# EAGLE design YOTSUBA_GNSS-UNIT_ver.1.0 (EAGLE 9.6.2)
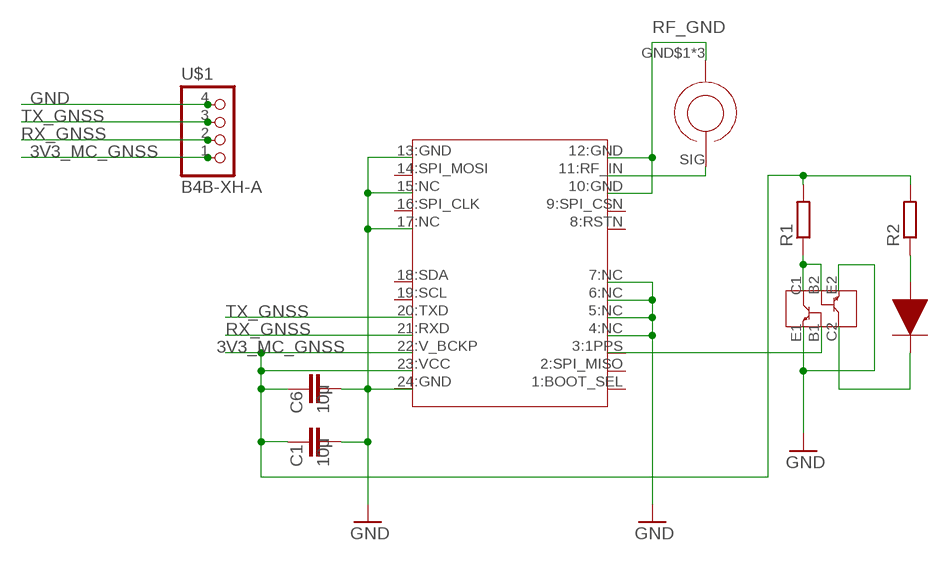
[diagram p0: schematic, sheet 1]

## Parts
C1  10μ  C-EUC2012  [C2012]
C6  10μ  C-EUC2012  [C2012]
ON/1PPS  LED_1608  [LED_1608]
R1  R-EU_M2012  [M2012]
R2  R-EU_M2012  [M2012]
U$1  B4B-XH-A  [B4B-XH-A]
U$2  ORION_B16  [ORION_B16]
U$3  HN1C01FU  [SOT65P210X100-6N]
U$5  U.FL-R  [U.FL-R]

## Nets
3V3_MC_GNSS [POWER]: C1.1 C6.1 R1.2 R2.2 U$1.1 U$2.22:V_BCKP U$2.23:VCC
GND [gnd]: C1.2 C6.2 U$1.4 U$2.4:NC U$2.5:NC U$2.6:NC U$2.7:NC U$2.13:GND U$2.15:NC U$2.17:NC U$2.24:GND U$3.E1 U$3.E2
N$10: ON/1PPS.A R2.1
N$11: ON/1PPS.C U$3.C2
N$12: U$2.3:1PPS U$3.B1
N$13: R1.1 U$3.B2 U$3.C1
N$18 [ant]: U$2.11:RF_IN U$5.SIG
RF_GND [gnd]: U$2.10:GND U$2.12:GND U$5.GND$1(GND) U$5.GND$2(GND) U$5.GND$3(GND)
RX_GNSS: U$1.2 U$2.21:RXD
TX_GNSS: U$1.3 U$2.20:TXD
Unconnected: U$2.1:BOOT_SEL U$2.2:SPI_MISO U$2.8:RSTN U$2.9:SPI_CSN U$2.14:SPI_MOSI U$2.16:SPI_CLK U$2.18:SDA U$2.19:SCL

## Library data of the parts
C1 C6 = rcl:C-EU: CAPACITOR, European symbol; SPICEPREFIX: C
ON/1PPS = LED_1608:LED_1608
R1 R2 = rcl:R-EU_: RESISTOR, European symbol; SPICEPREFIX: R
U$1 = MITSUBA_Connectors-v4.0:B4B-XH-A
U$2 = Orion_B16:ORION_B16
U$3 = HN1C01FU:HN1C01FU
U$5 = U.FL-R:U.FL-R

## Net classes
1 ant: clearance 0.2 mm
2 gnd: clearance 0.2 mm to class 1, clearance 0.508 mm
3 POWER: width 0.305 mm, clearance 0.254 mm

## Board
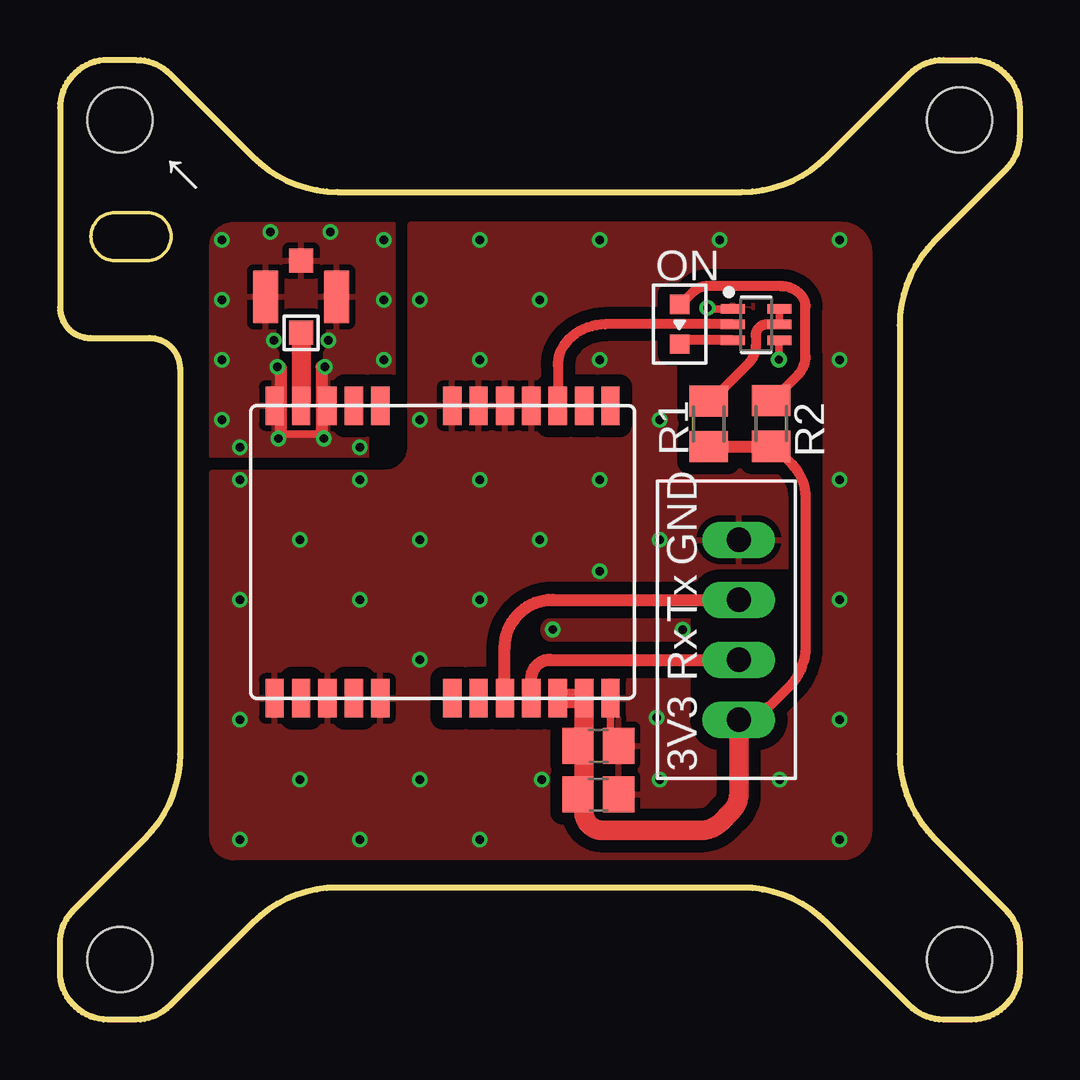
[diagram p1: board, top side]
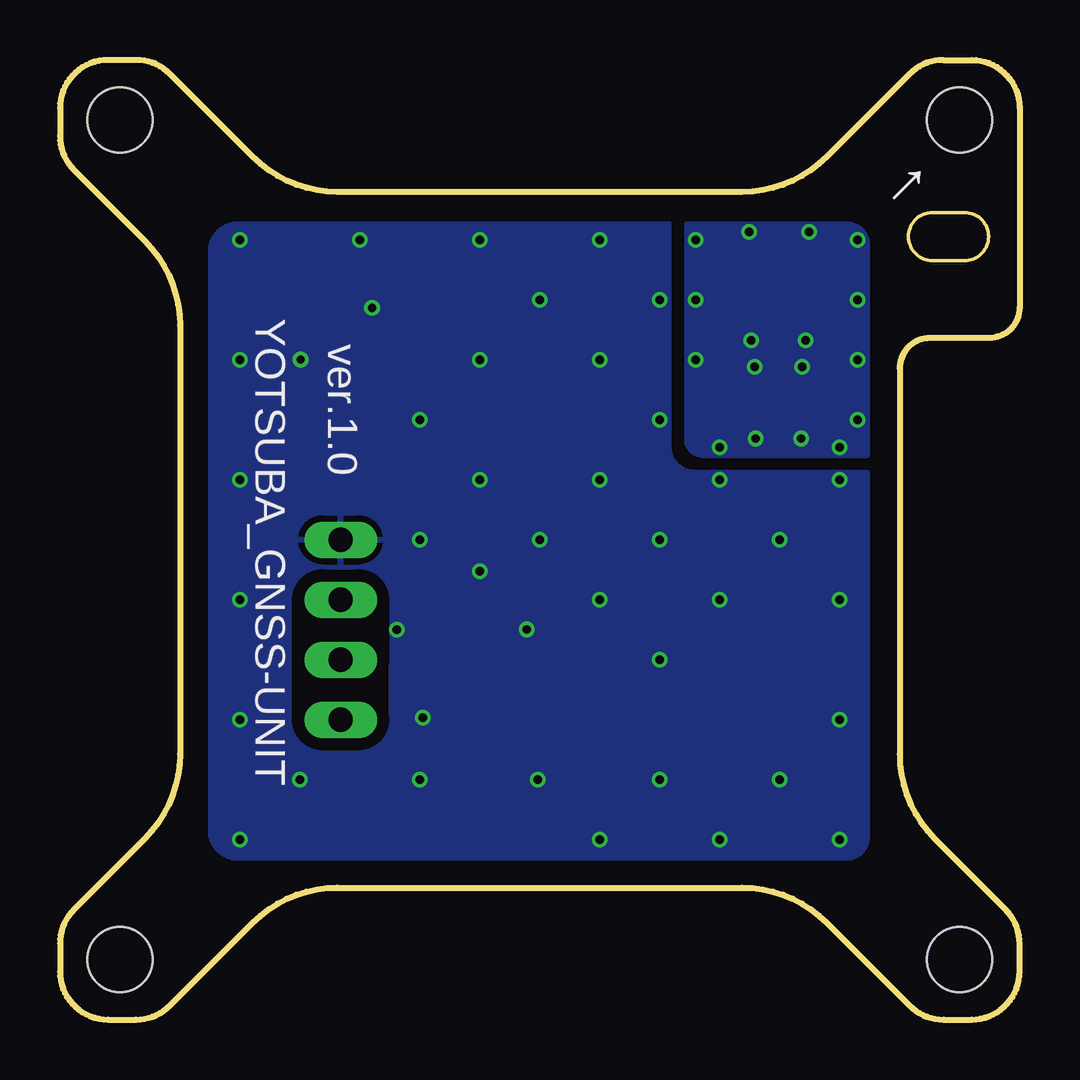
[diagram p2: board, bottom side, seen from below]

Size 40 x 40 mm. Coordinates in mm from the lower left corner, seen from the top.
Outline: 35.41,0.59 31.96,4.04 arc45 28.43,5.5 11.57,5.5 arc45 8.04,4.04 4.59,0.59 arc-45 3.17,0 2,0 arc-90 0,2 0,3.17 arc-45 0.59,4.59 3.54,7.54 arc45 5,11.07 5,27.14 arc90 3.73,28.41 1.27,28.41 arc-90 0,29.68 0,38 arc-90 2,40 3.17,40 arc-45 4.59,39.41 8.04,35.96 arc45 11.57,34.5 28.43,34.5 arc45 31.96,35.96 35.41,39.41 arc-45 36.83,40 38,40 arc-90 40,38 40,36.83 arc-45 39.41,35.41 36.46,32.46 arc45 35,28.93 35,11.07 arc45 36.46,7.54 39.41,4.59 arc-45 40,3.17 40,2 arc-90 38,0 36.83,0 arc-45 35.41,0.59
Outline: 4.63,32.64 arc-90 3.63,31.64 2.29,31.64 arc-90 1.29,32.64 arc-90 2.29,33.64 3.63,33.64 arc-90 4.63,32.64
Copper layers (1*16): Top 0.035mm / dielectric 1.53mm / Bottom 0.035mm
Design rules "pban_5mil-l2": minimum track width 5mil, minimum drill 0.3mm, track to track 5mil, track to pad 0.229mm, pad to pad 5mil, via to via 5mil, smd to smd 5mil, copper to edge 0.5mm, drill to drill 0.5mm, minimum pad ring 0.15mm, minimum via ring 0.15mm, stop-mask expansion 4mil, vias tented up to drill 0.35mm, thermal gap 10mil
Holes 2.7 mm at 2.5,2.5 37.5,2.5 37.5,37.5 2.5,37.5
tRestrict: area 31.6,21.9 to 31.8,27.3; area 25.7,26.5 to 26,27.4; area 29,18.5 to 30.5,18.8; area 12.9,23.2 to 13.4,24.4; area 29.4,26.9 to 30.6,28; area 9.4,24.6 to 10.7,24.6; 4 lines
bRestrict: 4 lines

### Footprints (pad centres in the part's own frame; a part is rotated, then mirrored left to right if it is on the bottom)
C2012 = smd 1.3 x 1.5: 1 -0.85,0; 2 0.85,0
LED_1608 = smd 0.8 x 0.8: A 0.4,0.4; C 2.05,0.4
M2012 = smd 1.3 x 1.6: 1 -0.95,0; 2 0.95,0
B4B-XH-A = drill 1.016 long: 1 0,0; 2 2.5,0; 3 5,0; 4 7.5,0
ORION_B16 = smd 1.6 x 0.8: 1:BOOT_SEL 12.2,1; 2:SPI_MISO 12.2,2.1; 3:1PPS 12.2,3.2; 4:NC 12.2,4.3; 5:NC 12.2,5.4; 6:NC 12.2,6.5; 7:NC 12.2,7.6; 8:RSTN 12.2,10.6; 9:SPI_CSN 12.2,11.7; 10:GND 12.2,12.8; 11:RF_IN 12.2,13.9; 12:GND 12.2,15; 13:GND 0,15; 14:SPI_MOSI 0,13.9; 15:NC 0,12.8; 16:SPI_CLK 0,11.7; 17:NC 0,10.6; 18:SDA 0,7.6; 19:SCL 0,6.5; 20:TXD 0,5.4; 21:RXD 0,4.3; 22:V_BCKP 0,3.2; 23:VCC 0,2.1; 24:GND 0,1
SOT65P210X100-6N = smd 1.005 x 0.397: B1 -0.962,0; B2 0.962,0; C1 0.962,0.65; C2 -0.962,-0.65; E1 -0.962,0.65; E2 0.962,-0.65
U.FL-R = smd 1.05 x 2.2: GND$1 -1.475,0; GND$2 1.475,0 | smd 1.05 x 1: GND$3 0,1.5; SIG 0,-1.5

### Placement (x,y rotation side)
C1  22.44,11.41 0 top
C6  22.44,9.38 0 top
ON/1PPS  25.43,30.21 270 top
R1  27.04,24.83 270 top
R2  29.65,24.85 270 top
U$1  28.3,12.5 90 top
U$2  23.95,13.39 90 top
U$3  29.02,28.97 0 top
U$5  10.05,30.13 0 top

### Tracks (layer width: path | path; a pad name or v marks a point on that pad's centre or on a via)
3V3_MC_GNSS
  Top 0.406: 29.63,23.88 R2.2 29.76,23.9 30.49,23.17 arc-45 31.08,21.75 31.08,15.54 arc-45 30.38,13.86 29.69,13.17 arc-45 28.99,12.88 28.61,12.5 U$1.1
  Top 0.508: R1.2 29.63,23.88
  Top 0.61: U$2.23:VCC 21.64,13.39
  Top 0.813: U$2.23:VCC 21.85,11.42 21.77,11.42 21.77,11.41 | 21.77,11.41 21.84,11.41 21.84,9.63 C6.1 21.84,9.13 21.84,8.67 arc45 22.07,8.11 arc45 22.61,7.89 26.73,7.89 arc45 27.55,8.23 27.97,8.65 arc45 28.3,9.44 U$1.1 | 21.77,11.41 C1.1 | 21.64,13.39 U$2.22:V_BCKP
GND  (via drill 0.35)
  Top 0.2: 26.99,29.62 v26.99,29.66
  Top 0.305: U$3.E2 29.97,28.31 v29.97,27.51 | U$3.E1 26.99,29.62 | U$2.24:GND 22.95,11.41 C1.2
  other vias: 25.96,16.25 10,10 15,10 12.5,7.5 17.5,7.5 12.5,17.5 10,20 15,20 17.5,17.5 20,20 25,20 22.5,22.5 17.5,22.5 12.5,22.5 7.5,22.5 7.5,17.5 7.5,12.5 7.5,7.5 32.5,7.5 32.5,12.5 32.5,17.5 32.5,22.5 32.5,27.5 32.5,32.5 27.5,32.5 22.5,32.5 17.5,32.5 17.5,27.5 20,30 22.5,27.5 25,25 25,10 30,10 15,15 15,30 15,25 20.54,16.26 20.08,10 24.88,12.58 22.5,18.69
  pour Top: 14.6,33.17 32.57,33.17 arc-90 33.75,31.99 33.75,7.89 arc-90 32.59,6.73 7.26,6.73 arc-90 6.33,7.66 6.33,22.82 13.52,22.82 arc90 14.6,23.91
  pour Bottom: 14.6,33.16 32.6,33.16 arc-90 33.74,32.02 33.74,7.88 arc-90 32.59,6.73 7.22,6.73 arc-90 6.33,7.62 6.33,22.81 13.55,22.81 arc90 14.6,23.86
N$10
  Top 0.406: R2.1 29.7,25.8 30.74,26.84 arc45 31.08,27.66 31.08,29.7 arc45 30.86,30.24 arc45 30.06,30.57 26.97,30.57 arc45 26.41,30.34 25.85,29.79 ON/1PPS.A
N$11
  Top 0.406: U$3.C2 25.99,28.32 ON/1PPS.C
N$12
  Top 0.406: U$3.B1 28.05,28.98 22.73,28.98 arc45 21.2,28.34 arc45 20.75,27.27 U$2.3:1PPS
N$13
  Top 0.305: U$3.B2 U$3.C1
  Top 0.406: U$3.B2 29.42,28.97 arc45 29.15,28.86 arc45 29,28.5 29,28.09 arc-45 28.69,27.34 27.13,25.78 R1.1
N$18
  Top 0.8: U$5.SIG U$2.11:RF_IN
RF_GND  (via drill 0.35)
  Top 0.305: 9.2,24.41 11,24.41 v11,24.22 | v9.07,27.21 9.2,27.21
  Top 0.508: 9.2,27.21 9.2,24.41 | v11.04,27.21 10.92,27.21 | 10.92,27.21 10.9,27.21 10.9,24.32 v11,24.22 | 10.94,27.21 10.92,27.21
  other vias: 13.5,32.5 13.5,27.5 6.75,32.5 6.75,27.5 7.5,23.85 12.5,23.85 11.18,28.31 8.91,28.32 13.5,30 6.75,30 6.75,25 8.77,32.83 11.27,32.83 9.1,24.22
  pour Top: 6.29,23.49 6.29,32.25 arc-90 7.22,33.18 13.93,33.18 13.93,24.16 arc-90 13.26,23.49
  pour Bottom: 6.32,23.52 6.32,32.27 arc-90 7.21,33.16 13.88,33.16 13.88,24.2 arc-90 13.21,23.52
RX_GNSS
  Top 0.508: U$2.21:RXD 19.65,14.22 arc-90 20.43,15 U$1.2
TX_GNSS
  Top 0.508: U$2.20:TXD 18.54,13.4 18.54,15.5 arc-90 20.54,17.5 U$1.3

### Text on the board
tPlace: →
bPlace: →
tNames: ON | GND | Tx | Rx | 3V3
bNames: YOTSUBA_GNSS-UNIT | ver.1.0